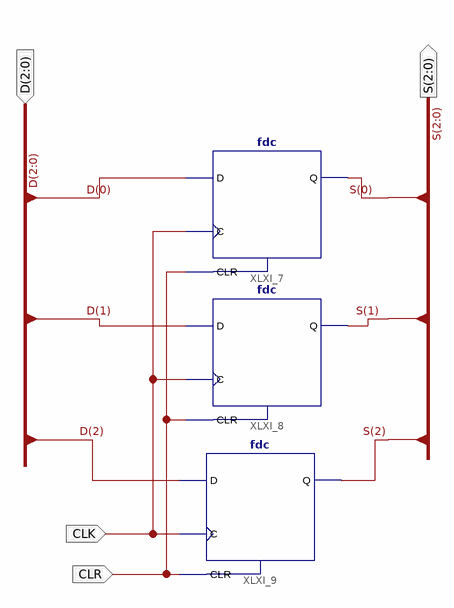
[diagram p0: schematic sheet 1]
// Xilinx ISE schematic PC.sch (spartan3e) as structural Verilog: 3 symbols, 4 ports
module PC (
  input  [2:0] D,
  input  CLK,
  input  CLR,
  output [2:0] S
);

  fdc XLXI_9 (.C(CLK), .CLR(CLR), .D(D[2]), .Q(S[2]));
  fdc XLXI_8 (.C(CLK), .CLR(CLR), .D(D[1]), .Q(S[1]));
  fdc XLXI_7 (.C(CLK), .CLR(CLR), .D(D[0]), .Q(S[0]));
endmodule
